# Altium project Atomwide_TwinMEMC.PrjPcb
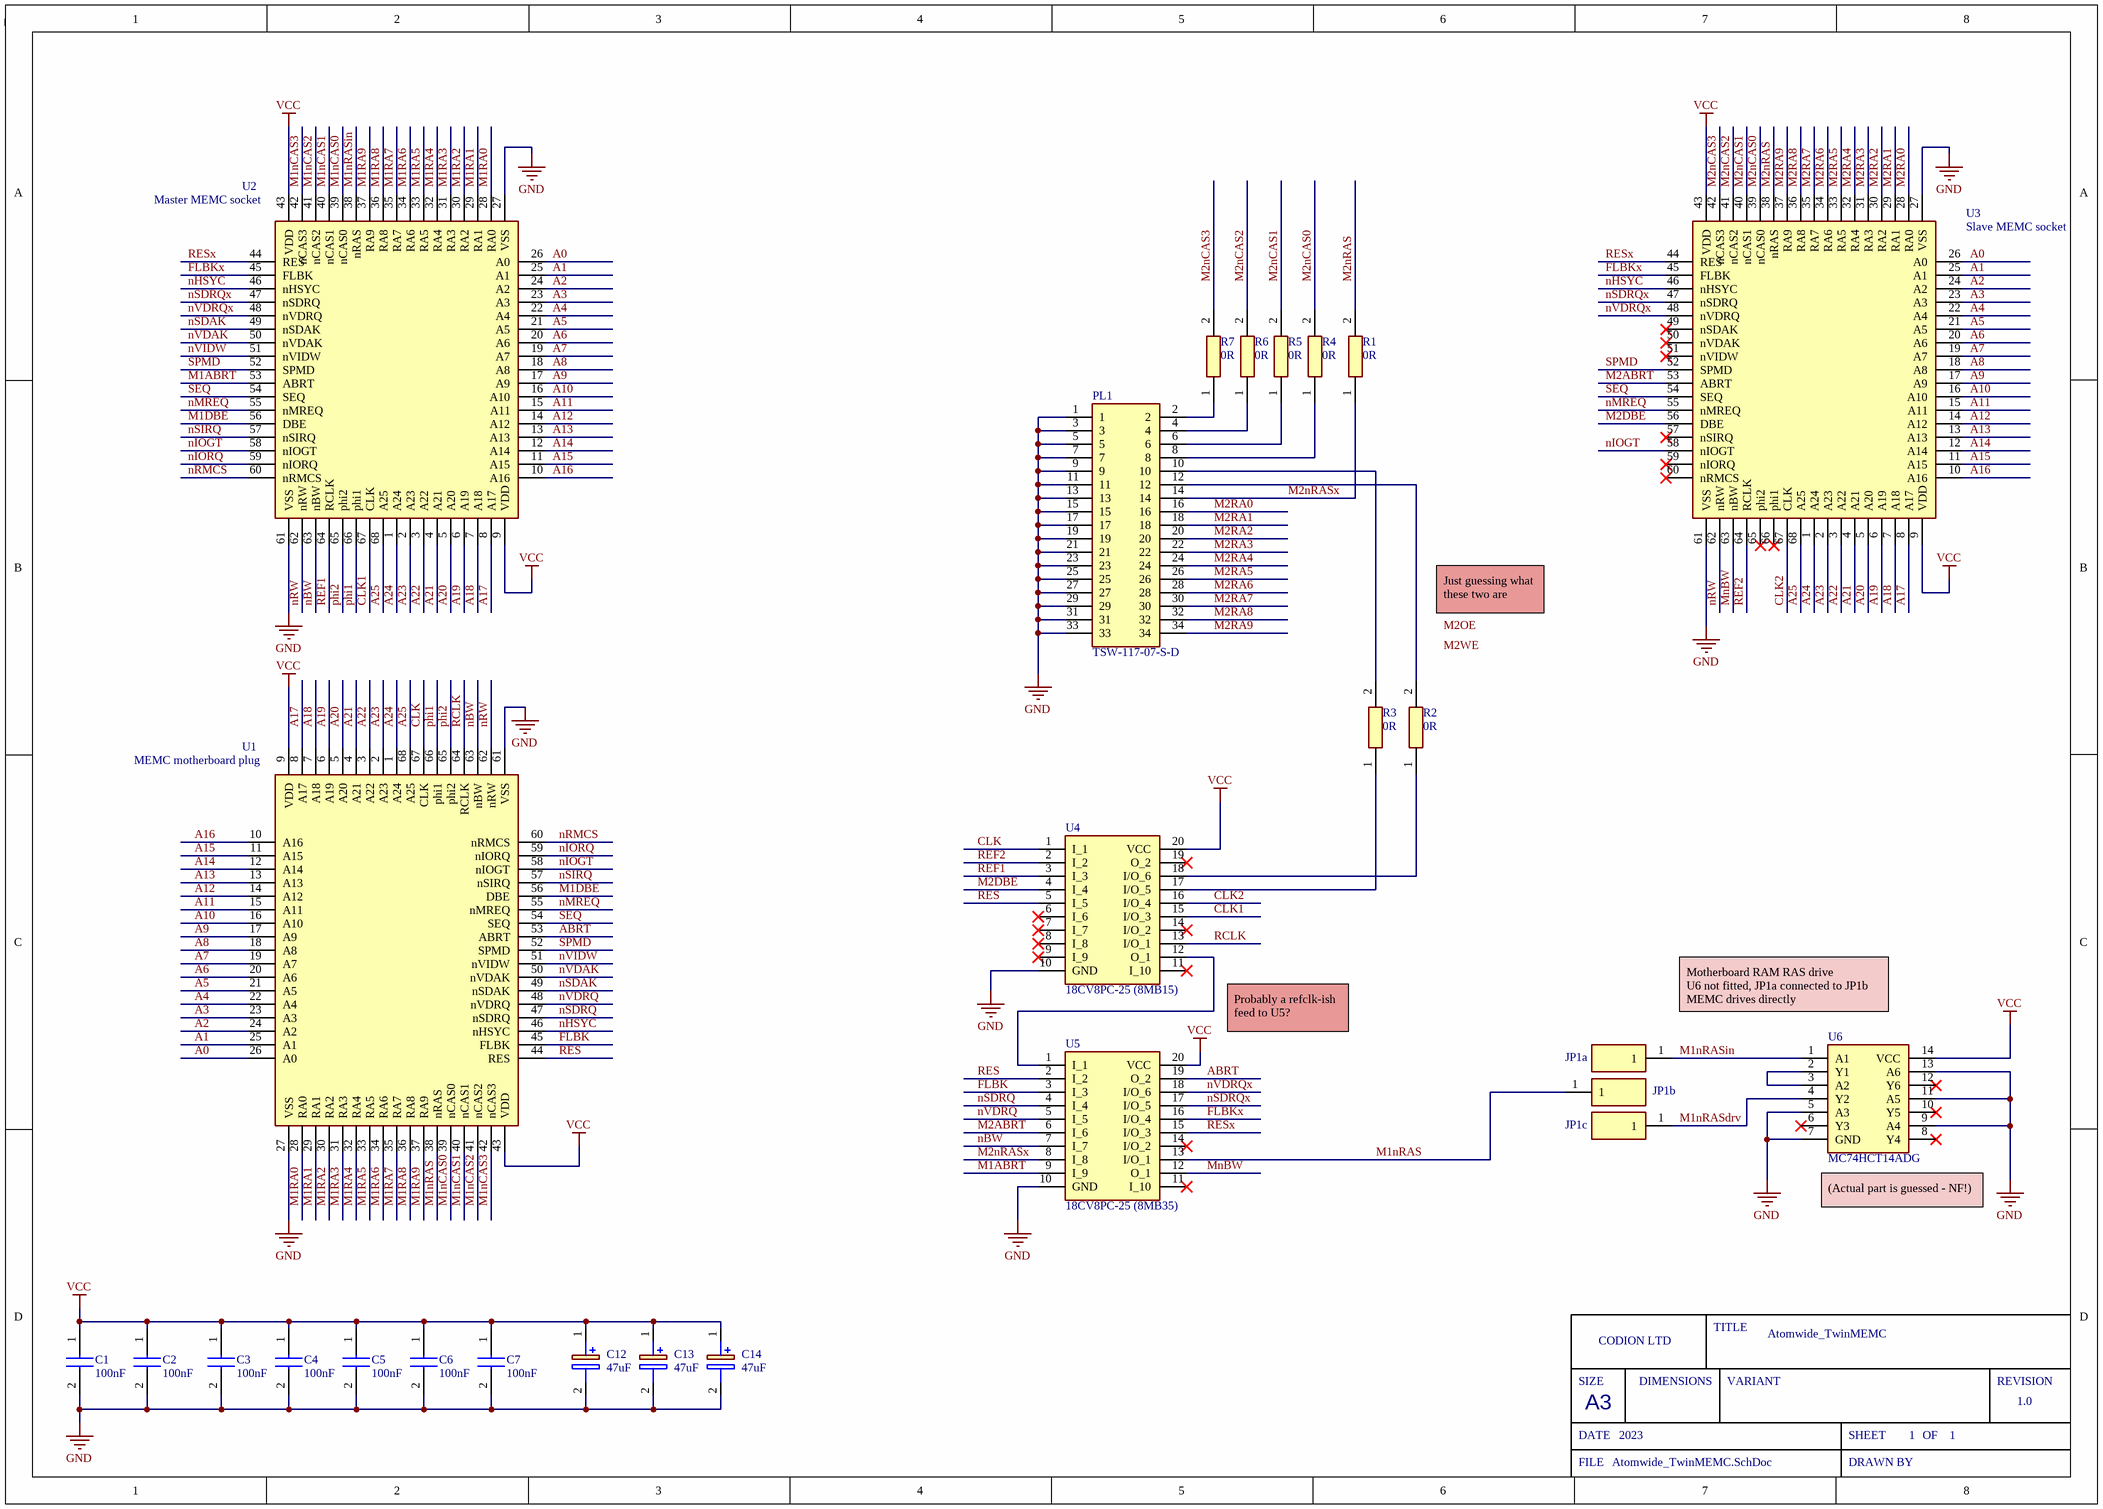
[diagram p0: Atomwide_TwinMEMC.SchDoc]
Sch_RevNo: 1.0; Sch_releaseDate: 2023; Project_Title: Atomwide_TwinMEMC; ProjectName: Atomwide_TwinMEMC; PCB_RevNo: 1.0; Engineer_Name: Codion Ltd; BOM_RevNo: 1.0
1 sheet, 27 parts. Net scope: global (net labels, ports and power ports of the same name join across sheets).
Board file: Atomwide_TwinMEMC.pcbdoc

## Sheet Atomwide_TwinMEMC.SchDoc: ARM2 to ARM3 Adapter
size A3; DocumentNumber: 1; SheetNumber: 1; SheetTotal: 1

### Parts
C1  100nF  [CAPC2012X145N]
C2  100nF  [CAPC2012X145N]
C3  100nF  [CAPC2012X145N]
C4  100nF  [CAPC2012X145N]
C5  100nF  [CAPC2012X145N]
C6  100nF  [CAPC2012X145N]
C7  100nF  [CAPC2012X145N]
C12  47uF  [EEE1AA101SP]
C13  47uF  [EEE1AA101SP]
C14  47uF  [EEE1AA101SP]
JP1a  (no value)  [TSW-101-XX-YY-S]
JP1b  (no value)  [TSW-101-XX-YY-S]
JP1c  (no value)  [TSW-101-XX-YY-S]
PL1  TSW-117-07-S-D  [TSW-117-XX-YY-D]
R1  0R  [RESC1005X40N]
R2  0R  [RESC1005X40N]
R3  0R  [RESC1005X40N]
R4  0R  [RESC1005X40N]
R5  0R  [RESC1005X40N]
R6  0R  [RESC1005X40N]
R7  0R  [RESC1005X40N]
U1  MEMC motherboard plug  [MEMC_Plug]
U2  Master MEMC socket  [MEMC_Socket]
U3  Slave MEMC socket  [MEMC_Socket]
U4  18CV8PC-25 (8MB15)  [DIP762W66P254L2692H508Q20N]
U5  18CV8PC-25 (8MB35)  [DIP762W66P254L2692H508Q20N]
U6  MC74HCT14ADG  [SOIC127P600X175-14N]

### Nets
GND: C1.2 C2.2 C3.2 C4.2 C5.2 C6.2 C7.2 C12.2(-) C13.2(-) C14.2(-) PL1.1 PL1.3 PL1.5 PL1.7 PL1.9 PL1.11 PL1.13 PL1.15 PL1.17 PL1.19 PL1.21 PL1.23 PL1.25 PL1.27 PL1.29 PL1.31 PL1.33 U1.27(VSS) U1.61(VSS) U2.27(VSS) U2.61(VSS) U3.27(VSS) U3.61(VSS) U4.10(GND) U5.10(GND) U6.5(A3) U6.7(GND) U6.9(A4) U6.11(A5) U6.13(A6)
VCC: C1.1 C2.1 C3.1 C4.1 C5.1 C6.1 C7.1 C12.1(+) C13.1(+) C14.1(+) U1.9(VDD) U1.43(VDD) U2.9(VDD) U2.43(VDD) U3.9(VDD) U3.43(VDD) U4.20(VCC) U5.20(VCC) U6.14(VCC)
A0: U1.26(A0) U2.26(A0) U3.26(A0)
A1: U1.25(A1) U2.25(A1) U3.25(A1)
A2: U1.24(A2) U2.24(A2) U3.24(A2)
A3: U1.23(A3) U2.23(A3) U3.23(A3)
A4: U1.22(A4) U2.22(A4) U3.22(A4)
A5: U1.21(A5) U2.21(A5) U3.21(A5)
A6: U1.20(A6) U2.20(A6) U3.20(A6)
A7: U1.19(A7) U2.19(A7) U3.19(A7)
A8: U1.18(A8) U2.18(A8) U3.18(A8)
A9: U1.17(A9) U2.17(A9) U3.17(A9)
A10: U1.16(A10) U2.16(A10) U3.16(A10)
A11: U1.15(A11) U2.15(A11) U3.15(A11)
A12: U1.14(A12) U2.14(A12) U3.14(A12)
A13: U1.13(A13) U2.13(A13) U3.13(A13)
A14: U1.12(A14) U2.12(A14) U3.12(A14)
A15: U1.11(A15) U2.11(A15) U3.11(A15)
A16: U1.10(A16) U2.10(A16) U3.10(A16)
A17: U1.8(A17) U2.8(A17) U3.8(A17)
A18: U1.7(A18) U2.7(A18) U3.7(A18)
A19: U1.6(A19) U2.6(A19) U3.6(A19)
A20: U1.5(A20) U2.5(A20) U3.5(A20)
A21: U1.4(A21) U2.4(A21) U3.4(A21)
A22: U1.3(A22) U2.3(A22) U3.3(A22)
A23: U1.2(A23) U2.2(A23) U3.2(A23)
A24: U1.1(A24) U2.1(A24) U3.1(A24)
A25: U1.68(A25) U2.68(A25) U3.68(A25)
ABRT: U1.53(ABRT) U5.19(O_2)
CLK: U1.67(CLK) U4.1(I_1)
CLK1: U2.67(CLK) U4.15(I/O_3)
CLK2: U3.67(CLK) U4.16(I/O_4)
FLBK: U1.45(FLBK) U5.3(I_3)
FLBKx: U2.45(FLBK) U3.45(FLBK) U5.16(I/O_4)
M1ABRT: U2.53(ABRT) U5.9(I_9)
M1DBE: U1.56(DBE) U2.56(DBE)
M1nCAS0: U1.39(nCAS0) U2.39(nCAS0)
M1nCAS1: U1.40(nCAS1) U2.40(nCAS1)
M1nCAS2: U1.41(nCAS2) U2.41(nCAS2)
M1nCAS3: U1.42(nCAS3) U2.42(nCAS3)
M1nRAS: JP1b.1 U1.38(nRAS) U5.13(I/O_1)
M1nRASdrv: JP1c.1 U6.4(Y2)
M1nRASin: JP1a.1 U2.38(nRAS) U6.1(A1)
M1RA0: U1.28(RA0) U2.28(RA0)
M1RA1: U1.29(RA1) U2.29(RA1)
M1RA2: U1.30(RA2) U2.30(RA2)
M1RA3: U1.31(RA3) U2.31(RA3)
M1RA4: U1.32(RA4) U2.32(RA4)
M1RA5: U1.33(RA5) U2.33(RA5)
M1RA6: U1.34(RA6) U2.34(RA6)
M1RA7: U1.35(RA7) U2.35(RA7)
M1RA8: U1.36(RA8) U2.36(RA8)
M1RA9: U1.37(RA9) U2.37(RA9)
M2ABRT: U3.53(ABRT) U5.6(I_6)
M2DBE: U3.56(DBE) U4.4(I_4)
M2nCAS0: R4.2 U3.39(nCAS0)
M2nCAS1: R5.2 U3.40(nCAS1)
M2nCAS2: R6.2 U3.41(nCAS2)
M2nCAS3: R7.2 U3.42(nCAS3)
M2nRAS: R1.2 U3.38(nRAS)
M2nRASx: PL1.14 R1.1 U5.8(I_8)
M2RA0: PL1.16 U3.28(RA0)
M2RA1: PL1.18 U3.29(RA1)
M2RA2: PL1.20 U3.30(RA2)
M2RA3: PL1.22 U3.31(RA3)
M2RA4: PL1.24 U3.32(RA4)
M2RA5: PL1.26 U3.33(RA5)
M2RA6: PL1.28 U3.34(RA6)
M2RA7: PL1.30 U3.35(RA7)
M2RA8: PL1.32 U3.36(RA8)
M2RA9: PL1.34 U3.37(RA9)
MnBW: U3.63(nBW) U5.12(O_1)
nBW: U1.63(nBW) U2.63(nBW) U5.7(I_7)
nHSYC: U1.46(nHSYC) U2.46(nHSYC) U3.46(nHSYC)
nIOGT: U1.58(nIOGT) U2.58(nIOGT) U3.58(nIOGT)
nIORQ: U1.59(nIORQ) U2.59(nIORQ)
nMREQ: U1.55(nMREQ) U2.55(nMREQ) U3.55(nMREQ)
nRMCS: U1.60(nRMCS) U2.60(nRMCS)
nRW: U1.62(nRW) U2.62(nRW) U3.62(nRW)
nSDAK: U1.49(nSDAK) U2.49(nSDAK)
nSDRQ: U1.47(nSDRQ) U5.4(I_4)
nSDRQx: U2.47(nSDRQ) U3.47(nSDRQ) U5.17(I/O_5)
nSIRQ: U1.57(nSIRQ) U2.57(nSIRQ)
nVDAK: U1.50(nVDAK) U2.50(nVDAK)
nVDRQ: U1.48(nVDRQ) U5.5(I_5)
nVDRQx: U2.48(nVDRQ) U3.48(nVDRQ) U5.18(I/O_6)
nVIDW: U1.51(nVIDW) U2.51(nVIDW)
phi1: U1.66(phi1) U2.66(phi1)
phi2: U1.65(phi2) U2.65(phi2)
RCLK: U1.64(RCLK) U4.13(I/O_1)
REF1: U2.64(RCLK) U4.3(I_3)
REF2: U3.64(RCLK) U4.2(I_2)
RES: U1.44(RES) U4.5(I_5) U5.2(I_2)
RESx: U2.44(RES) U3.44(RES) U5.15(I/O_3)
SEQ: U1.54(SEQ) U2.54(SEQ) U3.54(SEQ)
SPMD: U1.52(SPMD) U2.52(SPMD) U3.52(SPMD)
NetPL1_2: PL1.2 R7.1
NetPL1_4: PL1.4 R6.1
NetPL1_6: PL1.6 R5.1
NetPL1_8: PL1.8 R4.1
NetPL1_10: PL1.10 R3.2
NetPL1_12: PL1.12 R2.2
NetR2_1: R2.1 U4.18(I/O_6)
NetR3_1: R3.1 U4.17(I/O_5)
NetU4_12: U4.12(O_1) U5.1(I_1)
NetU6_2: U6.2(Y1) U6.3(A2)

Not connected (* = marked no-connect by the designer): U3 49(nSDAK)* 50(nVDAK)* 51(nVIDW)* 57(nSIRQ)* 59(nIORQ)* 60(nRMCS)* 65(phi2)* 66(phi1)*; U4 6(I_6)* 7(I_7)* 8(I_8)* 9(I_9)* 11(I_10)* 14(I/O_2)* 19(O_2)*; U5 11(I_10)* 14(I/O_2)*; U6 6(Y3)* 8(Y4)* 10(Y5)* 12(Y6)*

### Notes on the sheet
- Just guessing what these two are
- Probably a refclk-ish feed to U5?
- Motherboard RAM RAS drive
  U6 not fitted, JP1a connected to JP1b
  MEMC drives directly
- (near U6) (Actual part is guessed - NF!)
- Labels drawn without touching a wire or pin: M2OE, M2WE
- SIZE
- CODION LTD
- DIMENSIONS
- TITLE
- VARIANT
- REVISION
- DATE
- A3
- SHEET
- OF
- FILE
- DRAWN BY

### Library data of the parts
C1-C7 = C2012X7R1H104K125AM: Capacitor; Manufacturer_Name: TDK; Datasheet Link: https://product.tdk.com/info/en/catalog/datasheets/mlcc_commercial_midvoltage_en.pdf; Height: 1.45mm; Manufacturer_Part_Number: C2012X7R1H104K125AM; Mouser Part Number: 810-C2012X7R1H104KT5; Mouser Price/Stock: https://www.mouser.com/Search/Refine.aspx?Keyword=810-C2012X7R1H104KT5; Arrow Part Number: C2012X7R1H104K125AM; Arrow Price/Stock: https://www.arrow.com/en/products/c2012x7r1h104k125am/tdk
C12-C14 = EEE1VA470WP: Capacitor Polarised; Manufacturer_Name: Panasonic; Datasheet Link: http://industrial.panasonic.com/cdbs/www-data/pdf/RDE0000/ABA0000C1145.pdf; Height: 7.8mm; Manufacturer_Part_Number: EEE1VA470WP
JP1a JP1b JP1c = TSW-101-07-G-S: Connector; Manufacturer_Name: SAMTEC; Datasheet Link: http://suddendocs.samtec.com/prints/tsw-xxx-xx-xxx-x-xx-xxx-mkt.pdf; Manufacturer_Part_Number: TSW-101-07-G-S; Mouser Part Number: 200-TSW10107GS; Mouser Price/Stock: https://www.mouser.co.uk/ProductDetail/Samtec/TSW-101-07-G-S?qs=hzq9O0YpnZscfPe5oPvABA%3D%3D; Arrow Part Number: TSW-101-07-G-S; Arrow Price/Stock: https://www.arrow.com/en/products/tsw-101-07-g-s/samtec?region=europe
PL1 = TSW-117-07-S-D: Connector; Manufacturer_Name: SAMTEC; Datasheet Link: http://suddendocs.samtec.com/prints/tsw-xxx-xx-xxx-x-xx-xxx-mkt.pdf; Manufacturer_Part_Number: TSW-117-07-S-D; Mouser Part Number: 200-TSW11707SD; Mouser Price/Stock: https://www.mouser.com/Search/Refine.aspx?Keyword=200-TSW11707SD; Arrow Part Number: TSW-117-07-S-D; Arrow Price/Stock: https://www.arrow.com/en/products/tsw-117-07-s-d/samtec
R1-R7 = CRCW040210K0FKEDHP: Resistor; Manufacturer_Name: Vishay; Datasheet Link: http://www.vishay.com/docs/20035/dcrcwe3.pdf; Height: 0.4mm; Manufacturer_Part_Number: CRCW040210K0FKEDHP; Mouser Part Number: 71-CRCW040210K0FKEDH; Mouser Price/Stock: https://www.mouser.co.uk/ProductDetail/Vishay-Dale/CRCW040210K0FKEDHP?qs=FlFvgi4rxBxmIiaeyFjrkA%3D%3D; Arrow Part Number: CRCW040210K0FKEDHP; Arrow Price/Stock: https://www.arrow.com/en/products/crcw040210k0fkedhp/vishay?region=nac
U1 = MEMC_Plug: MEMC plug
U2 U3 = MEMC_Skt: MEMC socket; Manufacturer_Name: 3M; Manufacturer_Part_Number: 8468-21B1-RK-TR; Datasheet Link: https://www.arrow.com/en/products/8468-21b1-rk-tr/3m; Height: 4.6mm; Mouser Part Number: 517-8468-21B1-RK-TR; Mouser Price/Stock: https://www.mouser.co.uk/ProductDetail/3M-Electronic-Solutions-Division/8468-21B1-RK-TR?qs=X%2F%2F06fXhnJ18zOj3KK47CQ%3D%3D; Arrow Part Number: 8468-21B1-RK-TR; Arrow Price/Stock: https://www.arrow.com/en/products/8468-21b1-rk-tr/3m
U4 U5 = PAL16R4AMJ: Integrated Circuit; Manufacturer_Name: Texas Instruments; Datasheet Link: http://www.ti.com/lit/ds/symlink/pal16r4am.pdf; Height: 5.08mm; Manufacturer_Part_Number: PAL16R4AMJ; Mouser Part Number: 595-PAL16R4AMJ; Mouser Price/Stock: https://www.mouser.com/Search/Refine.aspx?Keyword=595-PAL16R4AMJ
U6 = MC74HCT14ADG: Integrated Circuit; Manufacturer_Name: onsemi; Datasheet Link: http://www.onsemi.com/pub/Collateral/MC74HCT14A-D.PDF; Height: 1.75mm; Manufacturer_Part_Number: MC74HCT14ADG; Mouser Part Number: 863-MC74HCT14ADG; Mouser Price/Stock: https://www.mouser.co.uk/ProductDetail/onsemi/MC74HCT14ADG?qs=qg33o%252B8vzFoyV2PIjKzsVw%3D%3D; Arrow Part Number: MC74HCT14ADG; Arrow Price/Stock: https://www.arrow.com/en/products/mc74hct14adg/on-semiconductor?region=europe